# Altium schematic sheet ats_relay.SchDoc
size A
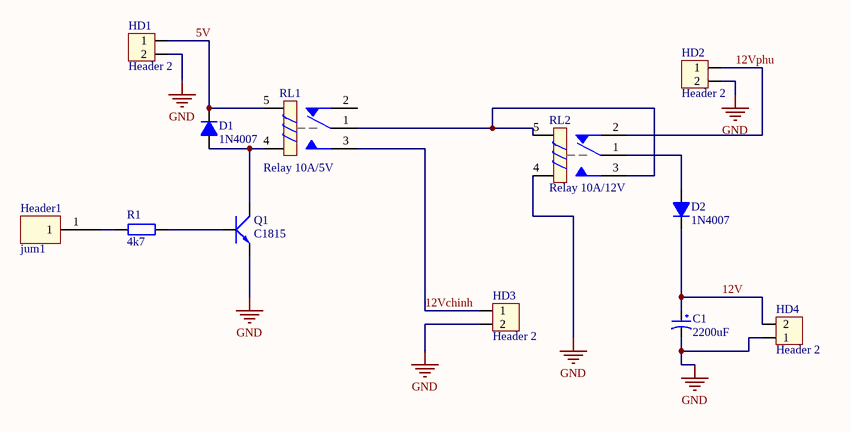
[diagram p0: ats_relay.SchDoc]

## Parts
C1  2200uF  [CP1/2]
D1  1N4007  [D1A]
D2  1N4007  [D1A]
HD1  Header 2  [HED2]
HD2  Header 2  [HED2]
HD3  Header 2  [HED2]
HD4  Header 2  [HED2]
Header1  jum1  [PCBComponent_1]
Q1  C1815  [QTO-92]
R1  4k7  [R1/4W]
RL1  Relay 10A/5V  [RL_SPDT_10A]
RL2  Relay 10A/12V  [RL_SPDT_10A]

## Nets
GND: C1.2 HD1.2 HD2.2 HD3.2 HD4.1 Q1.1(E) RL2.4
5V: D1.2(K) HD1.1 RL1.5
12V: C1.1 D2.2(K) HD4.2
12Vchinh: HD3.1 RL1.3
12Vphu: HD2.1 RL2.2
NetD1_1: D1.1(A) Q1.2(C) RL1.4
NetD2_1: D2.1(A) RL2.1
NetHeader1_1: Header1.1 R1.1
NetQ1_3: Q1.3(B) R1.2
NetRL1_1: RL1.1 RL2.3 RL2.5

Not connected (* = marked no-connect by the designer): RL1 2

## Library data of the parts
C1 = CP1: Cap P  0,1uF < 22uF , 16 - 50V; Value: 10uF/50V; Description 1: 10 => 220uF/6,3V/10V - 10uF => 100uF/16V; Description 2: 0,1uF => 33uF/50V - 10uF => 22uF/63V; Description 3: 0,47uF => 10uF/100V
D1 D2 = D1A: Diode 1A; Value: 1N4007
HD1-HD4 = Hed2: Header 2 (Green); Value: Header 2
Q1 = C1815: NPN 600mW, ECB; Value: C1815
R1 = R1/4W: Resistor 1/4W; Value: R1/4W - 1K
RL1 RL2 = Relay 1: Relay SPDT,10A - 12VDC 5 Pin; Value: Relay SPDT, 10A, 12V